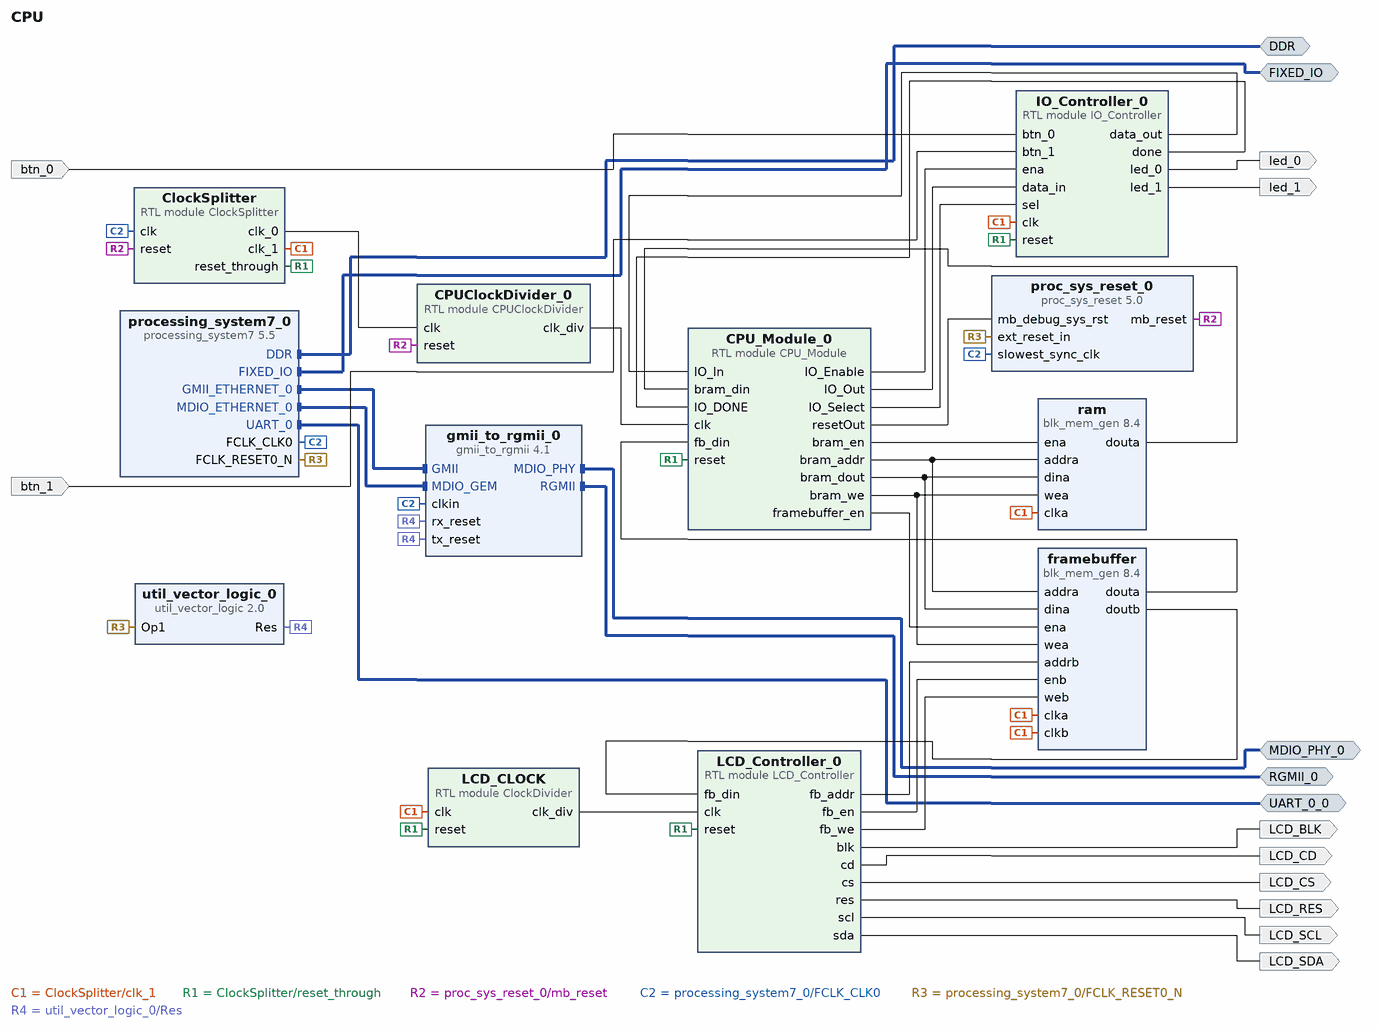
[diagram p0: block diagram of the top level]
# Vivado block design CPU, xc7z020clg484-1, Vivado 2024.1.2
create_bd_design CPU

create_bd_intf_port -mode Master -vlnv xilinx.com:interface:ddrx_rtl:1.0 DDR
create_bd_intf_port -mode Master -vlnv xilinx.com:display_processing_system7:fixedio_rtl:1.0 FIXED_IO
create_bd_intf_port -mode Master -vlnv xilinx.com:interface:mdio_rtl:1.0 MDIO_PHY_0
create_bd_intf_port -mode Master -vlnv xilinx.com:interface:rgmii_rtl:1.0 RGMII_0
create_bd_intf_port -mode Master -vlnv xilinx.com:interface:uart_rtl:1.0 UART_0_0
create_bd_port -dir I btn_0
create_bd_port -dir O led_0
create_bd_port -dir I btn_1
create_bd_port -dir O led_1
create_bd_port -dir O LCD_SCL
create_bd_port -dir O LCD_SDA
create_bd_port -dir O LCD_CS
create_bd_port -dir O LCD_BLK
create_bd_port -dir O LCD_RES
create_bd_port -dir O LCD_CD

create_bd_cell -type ip -vlnv xilinx.com:ip:processing_system7:5.5 processing_system7_0
set_property -dict [list \
  CONFIG.PCW_ENET0_ENET0_IO EMIO \
  CONFIG.PCW_ENET0_GRP_MDIO_ENABLE 1 \
  CONFIG.PCW_ENET0_GRP_MDIO_IO EMIO \
  CONFIG.PCW_ENET0_PERIPHERAL_ENABLE 1 \
  CONFIG.PCW_ENET_RESET_ENABLE 0 \
  CONFIG.PCW_FPGA0_PERIPHERAL_FREQMHZ 200 \
  CONFIG.PCW_GPIO_MIO_GPIO_ENABLE 1 \
  CONFIG.PCW_GPIO_MIO_GPIO_IO MIO \
  CONFIG.PCW_I2C_RESET_ENABLE 0 \
  CONFIG.PCW_SD0_GRP_CD_ENABLE 0 \
  CONFIG.PCW_SD0_GRP_WP_ENABLE 0 \
  CONFIG.PCW_SD0_PERIPHERAL_ENABLE 1 \
  CONFIG.PCW_SD0_SD0_IO {MIO 40 .. 45} \
  CONFIG.PCW_SDIO_PERIPHERAL_FREQMHZ 100 \
  CONFIG.PCW_UART0_PERIPHERAL_ENABLE 1 \
  CONFIG.PCW_UART0_UART0_IO EMIO \
  CONFIG.PCW_UART_PERIPHERAL_FREQMHZ 100 \
  CONFIG.PCW_UIPARAM_DDR_BUS_WIDTH {16 Bit} \
  CONFIG.PCW_UIPARAM_DDR_PARTNO {MT41K256M16 RE-125} \
  CONFIG.PCW_USB0_PERIPHERAL_ENABLE 1 \
  CONFIG.PCW_USB0_RESET_ENABLE 1 \
  CONFIG.PCW_USB0_RESET_IO {MIO 4} \
  CONFIG.PCW_USB0_USB0_IO {MIO 28 .. 39} \
  CONFIG.PCW_USB_RESET_ENABLE 1 \
  CONFIG.PCW_USB_RESET_SELECT {Share reset pin} \
  CONFIG.PCW_USE_M_AXI_GP0 0 \
] [get_bd_cells processing_system7_0]
# 201 more settings of processing_system7_0 are not shown: defaults, MIO pin electricals, DDR timing, and values the tool derives
create_bd_cell -type ip -vlnv xilinx.com:ip:gmii_to_rgmii:4.1 gmii_to_rgmii_0
set_property -dict {CONFIG.SupportLevel Include_Shared_Logic_in_Core} [get_bd_cells gmii_to_rgmii_0]
create_bd_cell -type ip -vlnv xilinx.com:ip:util_vector_logic:2.0 util_vector_logic_0
set_property -dict {CONFIG.C_OPERATION not CONFIG.C_SIZE 1} [get_bd_cells util_vector_logic_0]
create_bd_cell -type ip -vlnv xilinx.com:ip:proc_sys_reset:5.0 proc_sys_reset_0
create_bd_cell -type module -reference IO_Controller IO_Controller_0
create_bd_cell -type module -reference ClockDivider LCD_CLOCK
create_bd_cell -type ip -vlnv xilinx.com:ip:blk_mem_gen:8.4 ram
set_property -dict [list \
  CONFIG.Byte_Size 8 \
  CONFIG.Coe_File ../../../../../../../output.coe \
  CONFIG.Disable_Collision_Warnings false \
  CONFIG.Enable_32bit_Address false \
  CONFIG.Fill_Remaining_Memory_Locations true \
  CONFIG.Load_Init_File true \
  CONFIG.Use_Byte_Write_Enable true \
  CONFIG.Write_Depth_A 32768 \
  CONFIG.Write_Width_A 64 \
  CONFIG.use_bram_block Stand_Alone \
] [get_bd_cells ram]
create_bd_cell -type module -reference LCD_Controller LCD_Controller_0
create_bd_cell -type ip -vlnv xilinx.com:ip:blk_mem_gen:8.4 framebuffer
set_property -dict [list \
  CONFIG.Assume_Synchronous_Clk true \
  CONFIG.Coe_File ../../../../../../../image.coe \
  CONFIG.Fill_Remaining_Memory_Locations true \
  CONFIG.Load_Init_File true \
  CONFIG.Memory_Type True_Dual_Port_RAM \
  CONFIG.Use_Byte_Write_Enable false \
  CONFIG.Write_Depth_A 55040 \
  CONFIG.use_bram_block Stand_Alone \
] [get_bd_cells framebuffer]
create_bd_cell -type module -reference ClockSplitter ClockSplitter
create_bd_cell -type module -reference CPU_Module CPU_Module_0
create_bd_cell -type module -reference CPUClockDivider CPUClockDivider_0

# ---- connections ----

connect_bd_intf_net [get_bd_intf_ports MDIO_PHY_0] [get_bd_intf_pins gmii_to_rgmii_0/MDIO_PHY]
connect_bd_intf_net [get_bd_intf_ports RGMII_0] [get_bd_intf_pins gmii_to_rgmii_0/RGMII]
connect_bd_intf_net [get_bd_intf_ports DDR] [get_bd_intf_pins processing_system7_0/DDR]
connect_bd_intf_net [get_bd_intf_ports FIXED_IO] [get_bd_intf_pins processing_system7_0/FIXED_IO]
connect_bd_intf_net [get_bd_intf_pins processing_system7_0/GMII_ETHERNET_0] [get_bd_intf_pins gmii_to_rgmii_0/GMII]
connect_bd_intf_net [get_bd_intf_pins processing_system7_0/MDIO_ETHERNET_0] [get_bd_intf_pins gmii_to_rgmii_0/MDIO_GEM]
connect_bd_intf_net [get_bd_intf_ports UART_0_0] [get_bd_intf_pins processing_system7_0/UART_0]
connect_bd_net [get_bd_pins CPUClockDivider_0/clk_div] [get_bd_pins CPU_Module_0/clk]
connect_bd_net [get_bd_pins CPU_Module_0/IO_Enable] [get_bd_pins IO_Controller_0/ena]
connect_bd_net [get_bd_pins CPU_Module_0/IO_Out] [get_bd_pins IO_Controller_0/data_in]
connect_bd_net [get_bd_pins CPU_Module_0/IO_Select] [get_bd_pins IO_Controller_0/sel]
connect_bd_net [get_bd_pins CPU_Module_0/bram_addr] [get_bd_pins ram/addra] [get_bd_pins framebuffer/addra]
connect_bd_net [get_bd_pins CPU_Module_0/bram_dout] [get_bd_pins ram/dina] [get_bd_pins framebuffer/dina]
connect_bd_net [get_bd_pins CPU_Module_0/bram_en] [get_bd_pins ram/ena]
connect_bd_net [get_bd_pins CPU_Module_0/bram_we] [get_bd_pins ram/wea] [get_bd_pins framebuffer/wea]
connect_bd_net [get_bd_pins CPU_Module_0/framebuffer_en] [get_bd_pins framebuffer/ena]
connect_bd_net [get_bd_pins CPU_Module_0/resetOut] [get_bd_pins proc_sys_reset_0/mb_debug_sys_rst]
connect_bd_net -net ClockSplitter_0_clk_1 [get_bd_pins ClockSplitter/clk_1] \
  [get_bd_pins ram/clka] [get_bd_pins IO_Controller_0/clk] [get_bd_pins framebuffer/clka] [get_bd_pins framebuffer/clkb] \
  [get_bd_pins LCD_CLOCK/clk]
connect_bd_net [get_bd_pins ClockSplitter/clk_0] [get_bd_pins CPUClockDivider_0/clk]
connect_bd_net [get_bd_pins ClockSplitter/reset_through] \
  [get_bd_pins IO_Controller_0/reset] [get_bd_pins LCD_Controller_0/reset] [get_bd_pins CPU_Module_0/reset] \
  [get_bd_pins LCD_CLOCK/reset]
connect_bd_net [get_bd_pins IO_Controller_0/data_out] [get_bd_pins CPU_Module_0/IO_In]
connect_bd_net [get_bd_pins IO_Controller_0/done] [get_bd_pins CPU_Module_0/IO_DONE]
connect_bd_net [get_bd_pins IO_Controller_0/led_0] [get_bd_ports led_0]
connect_bd_net [get_bd_pins IO_Controller_0/led_1] [get_bd_ports led_1]
connect_bd_net [get_bd_pins LCD_CLOCK/clk_div] [get_bd_pins LCD_Controller_0/clk]
connect_bd_net [get_bd_pins LCD_Controller_0/blk] [get_bd_ports LCD_BLK]
connect_bd_net [get_bd_pins LCD_Controller_0/cd] [get_bd_ports LCD_CD]
connect_bd_net [get_bd_pins LCD_Controller_0/cs] [get_bd_ports LCD_CS]
connect_bd_net [get_bd_pins LCD_Controller_0/fb_addr] [get_bd_pins framebuffer/addrb]
connect_bd_net [get_bd_pins LCD_Controller_0/fb_en] [get_bd_pins framebuffer/enb]
connect_bd_net [get_bd_pins LCD_Controller_0/fb_we] [get_bd_pins framebuffer/web]
connect_bd_net [get_bd_pins LCD_Controller_0/res] [get_bd_ports LCD_RES]
connect_bd_net [get_bd_pins LCD_Controller_0/scl] [get_bd_ports LCD_SCL]
connect_bd_net [get_bd_pins LCD_Controller_0/sda] [get_bd_ports LCD_SDA]
connect_bd_net -net blk_mem_gen_0_douta [get_bd_pins ram/douta] [get_bd_pins CPU_Module_0/bram_din]
connect_bd_net -net btn_0_1 [get_bd_ports btn_0] [get_bd_pins IO_Controller_0/btn_0]
connect_bd_net -net btn_1_0_1 [get_bd_ports btn_1] [get_bd_pins IO_Controller_0/btn_1]
connect_bd_net [get_bd_pins framebuffer/douta] [get_bd_pins CPU_Module_0/fb_din]
connect_bd_net [get_bd_pins framebuffer/doutb] [get_bd_pins LCD_Controller_0/fb_din]
connect_bd_net [get_bd_pins proc_sys_reset_0/mb_reset] [get_bd_pins ClockSplitter/reset] [get_bd_pins CPUClockDivider_0/reset]
connect_bd_net [get_bd_pins processing_system7_0/FCLK_CLK0] \
  [get_bd_pins proc_sys_reset_0/slowest_sync_clk] [get_bd_pins gmii_to_rgmii_0/clkin] [get_bd_pins ClockSplitter/clk]
connect_bd_net [get_bd_pins processing_system7_0/FCLK_RESET0_N] [get_bd_pins util_vector_logic_0/Op1] [get_bd_pins proc_sys_reset_0/ext_reset_in]
connect_bd_net [get_bd_pins util_vector_logic_0/Res] [get_bd_pins gmii_to_rgmii_0/tx_reset] [get_bd_pins gmii_to_rgmii_0/rx_reset]

validate_bd_design
save_bd_design
